# Altium schematic sheet General.SchDoc
size A4; SheetNumber: 1; SheetTotal: 6
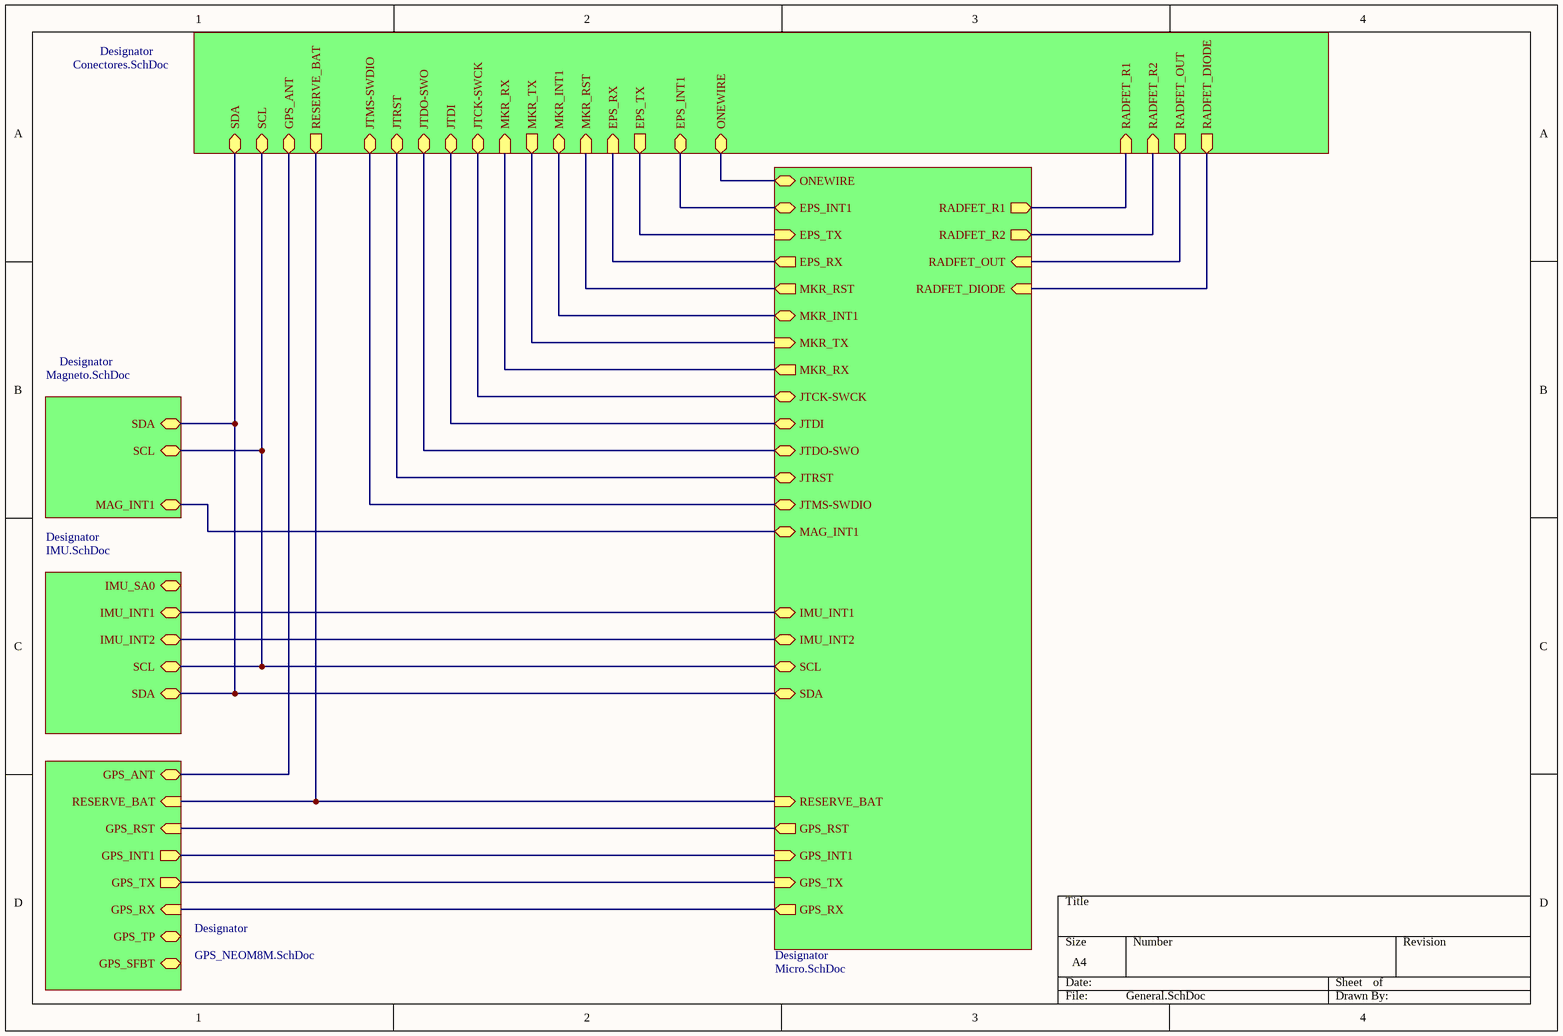
[diagram p0: General.SchDoc]

## Sub-sheets
Designator = GPS_NEOM8M.SchDoc: GPS_RST (in), GPS_INT1 (out), GPS_TX (out), GPS_RX (in), RESERVE_BAT (in), GPS_TP (bidir), GPS_SFBT (bidir), GPS_ANT (bidir)
Designator = Magneto.SchDoc: SCL (bidir), SDA (bidir), MAG_INT1 (bidir)
Designator = Micro.SchDoc: GPS_RX (out), GPS_TX (in), GPS_INT1 (in), GPS_RST (out), IMU_INT1 (bidir), SCL (bidir), SDA (bidir), IMU_INT2 (bidir), MAG_INT1 (bidir), MKR_RX (out), MKR_TX (in), JTCK-SWCK (bidir), JTDI (bidir), JTDO-SWO (bidir), JTRST (bidir), JTMS-SWDIO (bidir), MKR_INT1 (bidir), MKR_RST (out), RESERVE_BAT (in), EPS_TX (in), EPS_RX (out), ONEWIRE (bidir), EPS_INT1 (bidir), RADFET_R1 (out), RADFET_R2 (out), RADFET_OUT (in), RADFET_DIODE (in)
Designator = IMU.SchDoc: IMU_SA0 (bidir), IMU_INT1 (bidir), SCL (bidir), SDA (bidir), IMU_INT2 (bidir)
Designator = Conectores.SchDoc: MKR_RX (in), MKR_TX (out), JTCK-SWCK (bidir), JTDI (bidir), JTDO-SWO (bidir), JTRST (bidir), JTMS-SWDIO (bidir), SCL (bidir), SDA (bidir), MKR_INT1 (bidir), MKR_RST (in), RESERVE_BAT (out), GPS_ANT (bidir), EPS_TX (out), EPS_RX (in), ONEWIRE (bidir), EPS_INT1 (bidir), RADFET_R1 (in), RADFET_R2 (in), RADFET_OUT (out), RADFET_DIODE (out)

## Nets
(unnamed): sheet Designator/GPS_RST, sheet Designator/GPS_RST
(unnamed): sheet Designator/GPS_INT1, sheet Designator/GPS_INT1
(unnamed): sheet Designator/GPS_TX, sheet Designator/GPS_TX
(unnamed): sheet Designator/GPS_RX, sheet Designator/GPS_RX
(unnamed): sheet Designator/RESERVE_BAT, sheet Designator/RESERVE_BAT, sheet Designator/RESERVE_BAT
(unnamed): sheet Designator/GPS_ANT, sheet Designator/GPS_ANT
(unnamed): sheet Designator/SCL, sheet Designator/SCL, sheet Designator/SCL, sheet Designator/SCL
(unnamed): sheet Designator/SDA, sheet Designator/SDA, sheet Designator/SDA, sheet Designator/SDA
(unnamed): sheet Designator/MAG_INT1, sheet Designator/MAG_INT1
(unnamed): sheet Designator/IMU_INT1, sheet Designator/IMU_INT1
(unnamed): sheet Designator/IMU_INT2, sheet Designator/IMU_INT2
(unnamed): sheet Designator/MKR_RX, sheet Designator/MKR_RX
(unnamed): sheet Designator/MKR_TX, sheet Designator/MKR_TX
(unnamed): sheet Designator/JTCK-SWCK, sheet Designator/JTCK-SWCK
(unnamed): sheet Designator/JTDI, sheet Designator/JTDI
(unnamed): sheet Designator/JTDO-SWO, sheet Designator/JTDO-SWO
(unnamed): sheet Designator/JTRST, sheet Designator/JTRST
(unnamed): sheet Designator/JTMS-SWDIO, sheet Designator/JTMS-SWDIO
(unnamed): sheet Designator/MKR_INT1, sheet Designator/MKR_INT1
(unnamed): sheet Designator/MKR_RST, sheet Designator/MKR_RST
(unnamed): sheet Designator/EPS_TX, sheet Designator/EPS_TX
(unnamed): sheet Designator/EPS_RX, sheet Designator/EPS_RX
(unnamed): sheet Designator/ONEWIRE, sheet Designator/ONEWIRE
(unnamed): sheet Designator/EPS_INT1, sheet Designator/EPS_INT1
(unnamed): sheet Designator/RADFET_R1, sheet Designator/RADFET_R1
(unnamed): sheet Designator/RADFET_R2, sheet Designator/RADFET_R2
(unnamed): sheet Designator/RADFET_OUT, sheet Designator/RADFET_OUT
(unnamed): sheet Designator/RADFET_DIODE, sheet Designator/RADFET_DIODE